# Altium project IO_board.PrjPCB
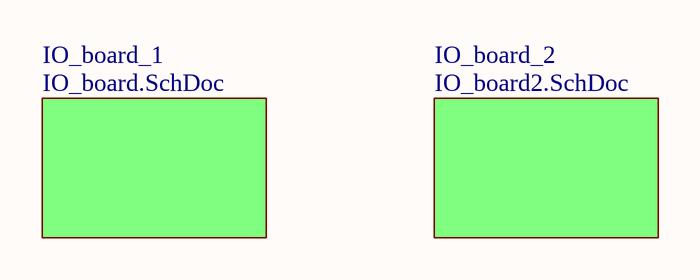
[diagram p0: IO_board_Top.SchDoc]
3 sheets, 152 parts. Net scope: global (net labels, ports and power ports of the same name join across sheets).
Board file: IO_board.PcbDoc
Sheets:
  IO_board_Top.SchDoc
    IO_board_1 = IO_board.SchDoc
    IO_board_2 = IO_board2.SchDoc

## Sheet IO_board_Top.SchDoc
size 294 x 198 mm

### Sub-sheets
IO_board_1 = IO_board.SchDoc: no entries
IO_board_2 = IO_board2.SchDoc: no entries

## Sheet IO_board.SchDoc
size 294 x 198 mm
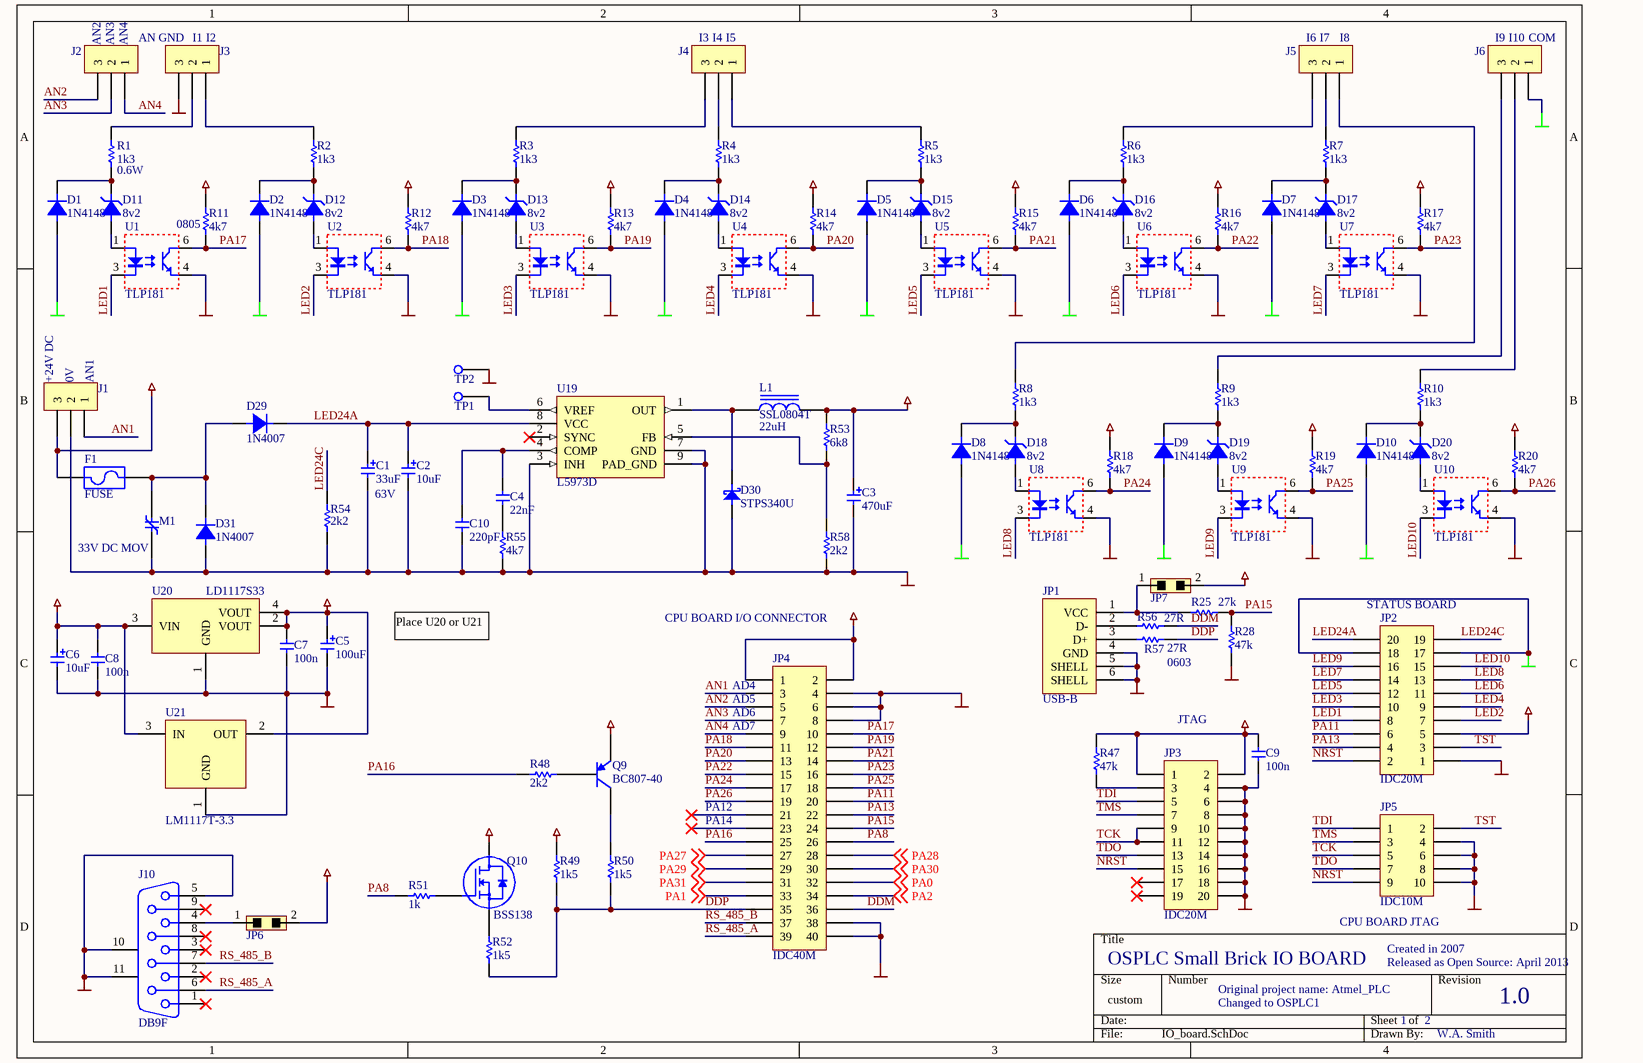
[diagram p1: IO_board.SchDoc]

### Parts
C1  63V  value 33uF  [CAP_100_RP]
C2  value 10uF  [CAP_100_RP]  (hidden comment: CAP_100_RP)
C3  value 470uF  [CAP_200_RP]  (hidden comment: CAP_200_RP)
C4  value 22nF  [0805]  (hidden comment: 0805)
C5  value 100uF  [CAP_100_RP]  (hidden comment: CAP_100_RP)
C6  value 10uF  [CAP_100_RP]  (hidden comment: CAP_100_RP)
C7  value 100n  [0805]  (hidden comment: 0805)
C8  value 100n  [0805]  (hidden comment: 0805)
C9  value 100n  [0603]  (hidden comment: 0603)
C10  value 220pF  [0805]  (hidden comment: 0805)
D1  value 1N4148  [DIODE_RAD_2.5MM]  (hidden comment: 1N4148_RAD)
D2  value 1N4148  [DIODE_RAD_2.5MM]  (hidden comment: 1N4148_RAD)
D3  value 1N4148  [DIODE_RAD_2.5MM]  (hidden comment: 1N4148_RAD)
D4  value 1N4148  [DIODE_RAD_2.5MM]  (hidden comment: 1N4148_RAD)
D5  value 1N4148  [DIODE_RAD_2.5MM]  (hidden comment: 1N4148_RAD)
D6  value 1N4148  [DIODE_RAD_2.5MM]  (hidden comment: 1N4148_RAD)
D7  value 1N4148  [DIODE_RAD_2.5MM]  (hidden comment: 1N4148_RAD)
D8  value 1N4148  [DIODE_RAD_2.5MM]  (hidden comment: 1N4148_RAD)
D9  value 1N4148  [DIODE_RAD_2.5MM]  (hidden comment: 1N4148_RAD)
D10  value 1N4148  [DIODE_RAD_2.5MM]  (hidden comment: 1N4148_RAD)
D11  value 8v2  [DIODE_RAD_2.5MM]  (hidden comment: 500mW Zener)
D12  value 8v2  [DIODE_RAD_2.5MM]  (hidden comment: 500mW Zener)
D13  value 8v2  [DIODE_RAD_2.5MM]  (hidden comment: 500mW Zener)
D14  value 8v2  [DIODE_RAD_2.5MM]  (hidden comment: 500mW Zener)
D15  value 8v2  [DIODE_RAD_2.5MM]  (hidden comment: 500mW Zener)
D16  value 8v2  [DIODE_RAD_2.5MM]  (hidden comment: 500mW Zener)
D17  value 8v2  [DIODE_RAD_2.5MM]  (hidden comment: 500mW Zener)
D18  value 8v2  [DIODE_RAD_2.5MM]  (hidden comment: 500mW Zener)
D19  value 8v2  [DIODE_RAD_2.5MM]  (hidden comment: 500mW Zener)
D20  value 8v2  [DIODE_RAD_2.5MM]  (hidden comment: 500mW Zener)
D29  value 1N4007  [DIODE_RAD_3MM]  (hidden comment: 1N4007 Radialy Mounted)
D30  STPS340U  [STPS2L25U]
D31  value 1N4007  [DIODE_RAD_3MM]  (hidden comment: 1N4007 Radialy Mounted)
F1  FUSE  [FUSE_5X20]
J1  PCB TERMINAL  [TERMINAL_3WAY_5MM]  (value not drawn)
J2  PCB TERMINAL  [TERMINAL_3WAY_5MM]  (value not drawn)
J3  PCB TERMINAL  [TERMINAL_3WAY_5MM]  (value not drawn)
J4  PCB TERMINAL  [TERMINAL_3WAY_5MM]  (value not drawn)
J5  PCB TERMINAL  [TERMINAL_3WAY_5MM]  (value not drawn)
J6  PCB TERMINAL  [TERMINAL_3WAY_5MM]  (value not drawn)
J10  DB9F  [DSUB1.385-2H9]
JP1  USB-B  [USB_B_VERT]
JP2  IDC20M  [IDC_20M_BOX]
JP3  IDC20M  [IDC_20M_BOX]
JP4  IDC40M  [IDC_40M_BOX]
JP5  IDC10M  [IDC_10M_BOX]
JP6  JUMPER2  [JUMPER2_254]  (value not drawn)
JP7  JUMPER2  [JUMPER2_254]  (value not drawn)
L1  SSL0804T  [SSL0804]
M1  33V DC MOV  [MOV_7.6mm]
Q9  BC807-40  [SO-G3/Y1]
Q10  BSS138  [SOT-23]
R1  0.6W  value 1k3  [RADIAL3MM]
R2  value 1k3  [RADIAL3MM]  (hidden comment: RES_RADIAL_3MM)
R3  value 1k3  [RADIAL3MM]  (hidden comment: RES_RADIAL_3MM)
R4  value 1k3  [RADIAL3MM]  (hidden comment: RES_RADIAL_3MM)
R5  value 1k3  [RADIAL3MM]  (hidden comment: RES_RADIAL_3MM)
R6  value 1k3  [RADIAL3MM]  (hidden comment: RES_RADIAL_3MM)
R7  value 1k3  [RADIAL3MM]  (hidden comment: RES_RADIAL_3MM)
R8  value 1k3  [RADIAL3MM]  (hidden comment: RES_RADIAL_3MM)
R9  value 1k3  [RADIAL3MM]  (hidden comment: RES_RADIAL_3MM)
R10  value 1k3  [RADIAL3MM]  (hidden comment: RES_RADIAL_3MM)
R11  0805  value 4k7  [0805]
R12  value 4k7  [0805]  (hidden comment: 0805)
R13  value 4k7  [0805]  (hidden comment: 0805)
R14  value 4k7  [0805]  (hidden comment: 0805)
R15  value 4k7  [0805]  (hidden comment: 0805)
R16  value 4k7  [0805]  (hidden comment: 0805)
R17  value 4k7  [0805]  (hidden comment: 0805)
R18  value 4k7  [0805]  (hidden comment: 0805)
R19  value 4k7  [0805]  (hidden comment: 0805)
R20  value 4k7  [0805]  (hidden comment: 0805)
R25  value 27k  [0805]  (hidden comment: 0805)
R28  value 47k  [0805]  (hidden comment: 0805)
R47  value 47k  [0805]  (hidden comment: 0805)
R48  value 2k2  [0805]  (hidden comment: 0805)
R49  value 1k5  [0805]  (hidden comment: 0805)
R50  value 1k5  [0805]  (hidden comment: 0805)
R51  value 1k  [0805]  (hidden comment: 0805)
R52  value 1k5  [0805]  (hidden comment: 0805)
R53  value 6k8  [0805]  (hidden comment: 0805)
R54  value 2k2  [AXIAL-0.3]  (hidden comment: Res1)
R55  value 4k7  [0805]  (hidden comment: 0805)
R56  value 27R  [0603]  (hidden comment: 0603)
R57  0603  value 27R  [0603]
R58  value 2k2  [0805]  (hidden comment: 0805)
TP1  TEST POINT  [TEST_POINT_TH]  (value not drawn)
TP2  TEST POINT  [TEST_POINT_TH]  (value not drawn)
U1  TLP181  [SOP4_2.54]
U2  TLP181  [SOP4_2.54]
U3  TLP181  [SOP4_2.54]
U4  TLP181  [SOP4_2.54]
U5  TLP181  [SOP4_2.54]
U6  TLP181  [SOP4_2.54]
U7  TLP181  [SOP4_2.54]
U8  TLP181  [SOP4_2.54]
U9  TLP181  [SOP4_2.54]
U10  TLP181  [SOP4_2.54]
U19  L5973D  [HSOP8]
U20  LD1117S33  [SOT-223]
U21  LM1117T-3.3  [TO220]

### Nets
GND: C1.2 C2.2 C3.2 C5.2 C6.2 C7.2 C8.2 C9.2 C10.1 D30.2(A) D31.2(A) J1.2 J3.3 J10.5 J10.10(MH1) J10.11(MH2) JP1.4(GND) JP1.5(SHELL) JP1.6(SHELL) JP2.1 JP3.4 JP3.6 JP3.8 JP3.10 JP3.12 JP3.14 JP3.16 JP3.18 JP3.20 JP4.4 JP4.6 JP4.8 JP4.38 JP4.40 JP5.4 JP5.6 JP5.8 JP5.10 M1.1 R28.1 R54.1 R55.1 R58.1 TP2.1 U1.4 U2.4 U3.4 U4.4 U5.4 U6.4 U7.4 U8.4 U9.4 U10.4 U19.3(INH) U19.7(GND) U19.9(PAD_GND) U20.1(GND) U21.1(GND)
IN_GND: D1.2(A) D2.2(A) D3.2(A) D4.2(A) D5.2(A) D6.2(A) D7.2(A) D8.2(A) D9.2(A) D10.2(A) J6.1 JP2.17 JP2.18
VCC3v3: C5.1 C7.1 C9.1 JP2.5 JP3.1 JP3.2 JP4.1 JP4.2 Q9.2(E) Q10.3(D) R11.2 R12.2 R13.2 R14.2 R15.2 R16.2 R17.2 R18.2 R19.2 R20.2 R47.2 R49.2 U20.2(VOUT) U20.4(VOUT) U21.2(OUT)
VCC5: C3.1 C6.1 C8.1 JP6.2 JP7.2 L1.2 R53.2 U20.3(VIN) U21.3(IN)
VCC24: F1.1 J1.3
AN1: J1.1 JP4.3
AN2: J2.3 JP4.5
AN3: J2.2 JP4.7
AN4: J2.1 JP4.9
DDM: JP4.36 R56.2
DDP: JP4.35 R49.1 R50.1 R52.1 R57.2
LED1: JP2.8 U1.3
LED2: JP2.7 U2.3
LED3: JP2.10 U3.3
LED4: JP2.9 U4.3
LED5: JP2.12 U5.3
LED6: JP2.11 U6.3
LED7: JP2.14 U7.3
LED8: JP2.13 U8.3
LED9: JP2.16 U9.3
LED10: JP2.15 U10.3
LED24A: C1.1 C2.1 D29.1(C) JP2.20 U19.8(VCC)
LED24C: JP2.19 R54.2
NRST: JP2.2 JP3.15 JP5.9
PA0: JP4.32 ; off-sheet PA0
PA1: JP4.33 ; off-sheet PA1
PA2: JP4.34 ; off-sheet PA2
PA8: JP4.26 R51.1
PA11: JP2.6 JP4.20
PA13: JP2.4 JP4.22
PA15: JP4.24 R25.2 R28.2
PA16: JP4.25 R48.1
PA17: JP4.10 R11.1 U1.6
PA18: JP4.11 R12.1 U2.6
PA19: JP4.12 R13.1 U3.6
PA20: JP4.13 R14.1 U4.6
PA21: JP4.14 R15.1 U5.6
PA22: JP4.15 R16.1 U6.6
PA23: JP4.16 R17.1 U7.6
PA24: JP4.17 R18.1 U8.6
PA25: JP4.18 R19.1 U9.6
PA26: JP4.19 R20.1 U10.6
PA27: JP4.27 ; off-sheet PA27
PA28: JP4.28 ; off-sheet PA28
PA29: JP4.29 ; off-sheet PA29
PA30: JP4.30 ; off-sheet PA30
PA31: JP4.31 ; off-sheet PA31
RS_485_A: J10.6 JP4.39
RS_485_B: J10.7 JP4.37
TCK: JP3.9 JP3.11 JP5.5
TDI: JP3.5 JP5.1
TDO: JP3.13 JP5.7
TMS: JP3.7 JP5.3
TST: JP2.3 JP5.2
NetC4_1: C4.1 R55.2
NetC4_2: C4.2 C10.2 U19.4(COMP)
NetD1_1: D1.1(C) D11.1(C) R1.1
NetD2_1: D2.1(C) D12.1(C) R2.1
NetD3_1: D3.1(C) D13.1(C) R3.1
NetD4_1: D4.1(C) D14.1(C) R4.1
NetD5_1: D5.1(C) D15.1(C) R5.1
NetD6_1: D6.1(C) D16.1(C) R6.1
NetD7_1: D7.1(C) D17.1(C) R7.1
NetD8_1: D8.1(C) D18.1(C) R8.1
NetD9_1: D9.1(C) D19.1(C) R9.1
NetD10_1: D10.1(C) D20.1(C) R10.1
NetD11_2: D11.2(A) U1.1
NetD12_2: D12.2(A) U2.1
NetD13_2: D13.2(A) U3.1
NetD14_2: D14.2(A) U4.1
NetD15_2: D15.2(A) U5.1
NetD16_2: D16.2(A) U6.1
NetD17_2: D17.2(A) U7.1
NetD18_2: D18.2(A) U8.1
NetD19_2: D19.2(A) U9.1
NetD20_2: D20.2(A) U10.1
NetD29_2: D29.2(A) D31.1(C) F1.2 M1.2
NetD30_1: D30.1(C) L1.1 U19.1(OUT)
NetJ3_1: J3.1 R2.2
NetJ3_2: J3.2 R1.2
NetJ4_1: J4.1 R5.2
NetJ4_2: J4.2 R4.2
NetJ4_3: J4.3 R3.2
NetJ5_1: J5.1 R8.2
NetJ5_2: J5.2 R7.2
NetJ5_3: J5.3 R6.2
NetJ6_2: J6.2 R10.2
NetJ6_3: J6.3 R9.2
NetJ10_4: J10.4 JP6.1
NetJP1_1: JP1.1(VCC) JP7.1 R25.1
NetJP1_2: JP1.2(D-) R56.1
NetJP1_3: JP1.3(D+) R57.1
NetJP3_3: JP3.3 R47.1
NetQ9_1: Q9.1(B) R48.2
NetQ9_3: Q9.3(C) R50.2
NetQ10_1: Q10.1(G) R51.2
NetQ10_2: Q10.2(S) R52.2
NetR53_1: R53.1 R58.2 U19.5(FB)
NetTP1_1: TP1.1 U19.6(VREF)

Not connected (* = marked no-connect by the designer): J10 1* 2* 3* 8* 9*; JP3 17* 19*; JP4 21* 23*; U19 2(SYNC)*

### Notes on the sheet
- (near J2) AN2
- (near J2) AN3
- (near J2) AN4
- AN GND
- (near J3) I1
- (near J3) I2
- (near J4) I3
- (near J4) I4
- (near J4) I5
- (near J5) I6
- (near J5) I7
- (near J5) I8
- (near J6) I9
- (near J6) I10
- (near J6) COM
- (near J1) +24V DC
- (near J1) 0V
- (near J1) AN1
- (near JP2) STATUS BOARD
- Place U20 or U21
- CPU BOARD I/O CONNECTOR
- (near JP4) AD4
- (near JP4) AD5
- (near JP4) AD6
- (near JP4) AD7
- JTAG
- (near JP4) PA12
- (near JP4) PA14
- (near JP5) CPU BOARD JTAG
- Created in 2007
- OSPLC Small Brick IO BOARD
- Original project name: Atmel_PLC
- Changed to OSPLC1
- Released as Open Source: April 2013
- 1.0
- 1
- 2
- W.A. Smith
- (in symbol SSL0804T) 22uH

### Library data of the parts
C1 C2 C5 C6 = CAP_100_RP: Electrolytic cap, 100 mil pitch
C3 = CAP_200_RP: Radial Electrolytic Capacitor, 200 thou pin spacing
C4 C7 C8 C10 = CAP_0805: 0805 footprint non-polarised capacitor
C9 = CAP_0603: 0603 footprint non-polorised capacitor
D1-D10 = 1N4148: Small signal diode
D11-D20 = ZENDER_500MW: 500mW Zener Diode
D29 D31 = 1N4007: 1N4007 Rectifier Diode Radialy Mounted
D30 = STPS340U: Power Schottky rectifier, ST
F1 = FUSE_5X20: 5mm by 20mm Fuse
J1-J6 = TERMINAL_3WAY_5MM: 5mm spaced PCB terminal, 3 pole
J10 = D Connector 9: Receptacle Assembly, 9 Position, Right Angle; Manufacturer: Generic Components; Package Information: Latest Revision: O; Positions: 9; Published: 15-Jun-2001; Revision: July-2002: Re-released for DXP Platform.; Datasheet: (1-Sep-1999); Package Reference: 788750; Publisher: Altium Limited; Class I: Connector; Orientation: Right Angle; Gender: Receptacle
JP1 = USB_B_VERT: Vertically mounting USB type B connector
JP2 JP3 = IDC_20M: 20 pin IDC male connector, vertical, box
JP4 = IDC_40M: 40 pin IDC male connector, vertical, box
JP5 = IDC_10M: 10 pin IDC male connector, vertical, box
JP6 JP7 = JUMPER2: 2 Pin Jumper, 2.54mm
L1 = SSL0804T: Yageo SMD Power Inductor
M1 = MOV_7.6MM: Metal Oxide Varistor
Q9 = BC807-40: PNP General Purpose Amplifier; Manufacturer: Fairchild Semiconductor; Revision 1: 11-July-2000: SIM Model Added.; Revision 2: July-2002: Re-released for DXP Platform.; Package Information: Latest Revision: Sep-1998; Class I: Discrete; Class II: BJT - Low Power; Published: 8-Jun-2000; Datasheet: Latest Revision: 1997; Package Reference: SOT-23A; Publisher: Altium Limited
Q10 = BSS138: Fairchild, N-channel MOSFET
R1-R10 = RES_RADIAL_3MM: Radialy mounted resistor
R11-R20 R25 R28 R47-R53 R55 R58 = RES_0805: 0805 footprint resistor
R54 = Res1: Resistor; Manufacturer: Generic Components; Class I: Passive; Published: 8-Jun-2000; Revision: July-2002: Re-released for DXP Platform.; Publisher: Altium Limited; Class II: Resistor
R56 R57 = RES_0603: 0603 footprint resistor
TP1 TP2 = TEST_POINT_TH: Through hole test point
U1-U10 = TLP181: Toshiba Photocoupler
  U1: Value: TLP181
U19 = L5973D: ST 2.5A switch step down switching regulator
U20 = LD1117S33: ST 3.3V LDO regulator
U21 = LM1117T3.3_VERT: 3.3V Regulator, 800mA, Vertical Mounted

## Sheet IO_board2.SchDoc
size 294 x 198 mm
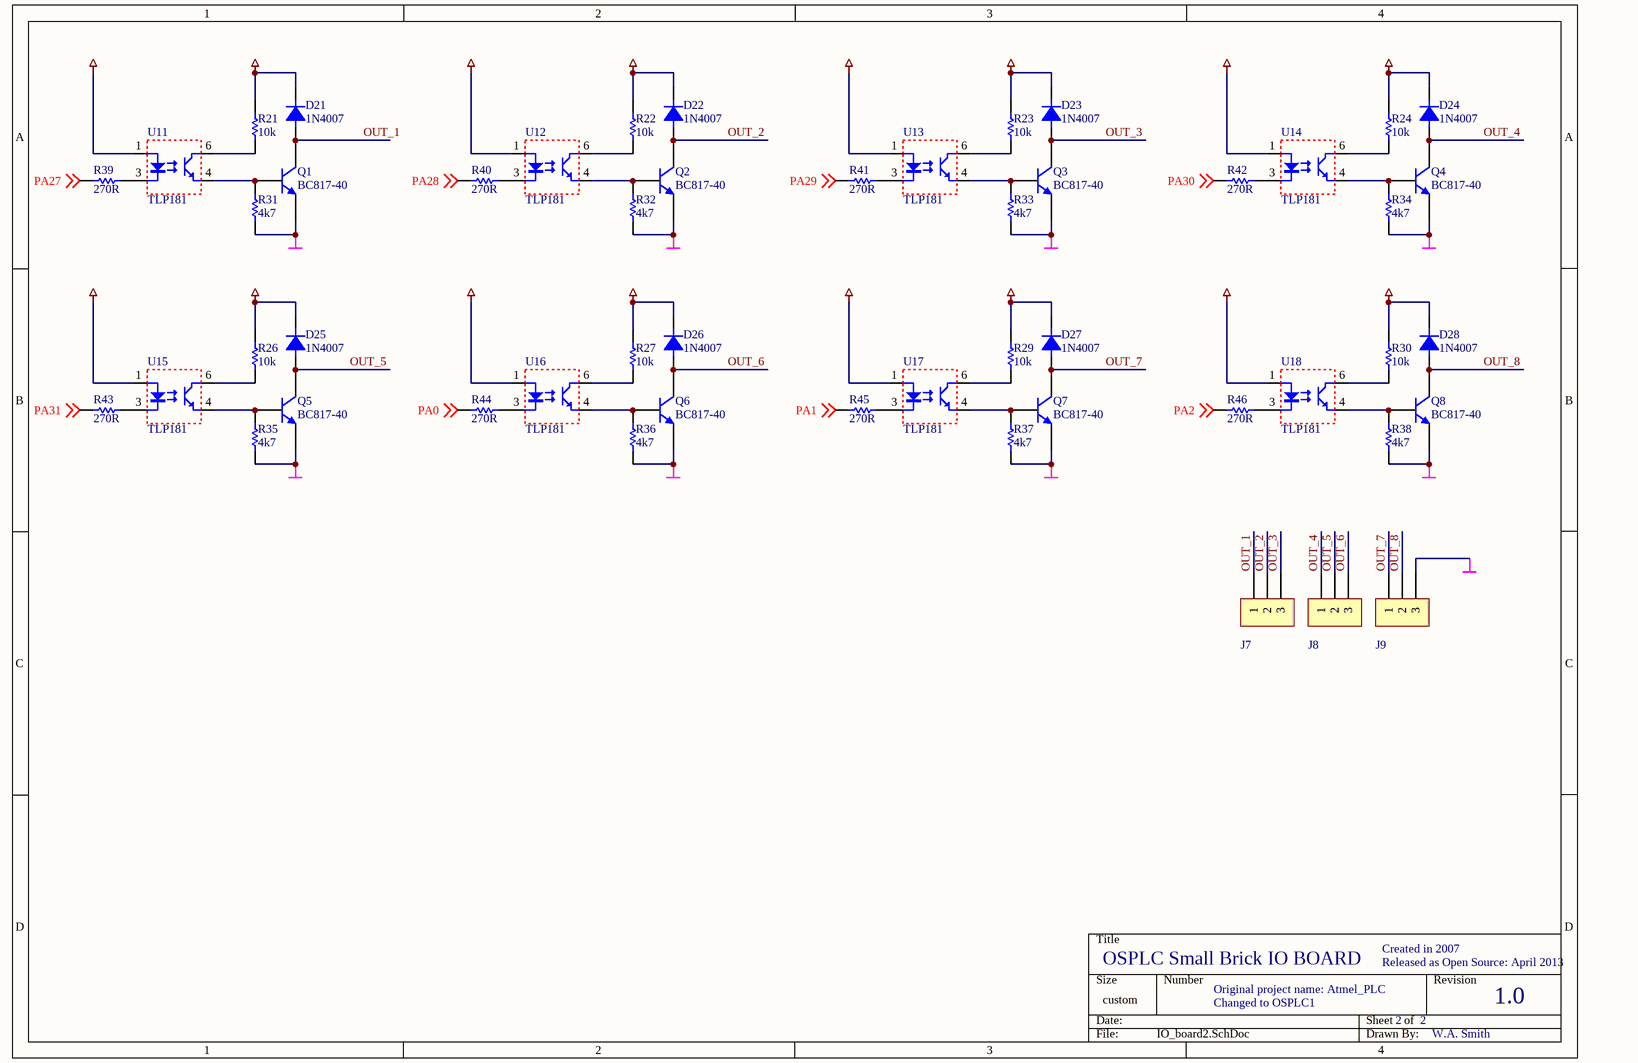
[diagram p2: IO_board2.SchDoc]

### Parts
D21  value 1N4007  [DIODE_RAD_3MM]  (hidden comment: 1N4007 Radialy Mounted)
D22  value 1N4007  [DIODE_RAD_3MM]  (hidden comment: 1N4007 Radialy Mounted)
D23  value 1N4007  [DIODE_RAD_3MM]  (hidden comment: 1N4007 Radialy Mounted)
D24  value 1N4007  [DIODE_RAD_3MM]  (hidden comment: 1N4007 Radialy Mounted)
D25  value 1N4007  [DIODE_RAD_3MM]  (hidden comment: 1N4007 Radialy Mounted)
D26  value 1N4007  [DIODE_RAD_3MM]  (hidden comment: 1N4007 Radialy Mounted)
D27  value 1N4007  [DIODE_RAD_3MM]  (hidden comment: 1N4007 Radialy Mounted)
D28  value 1N4007  [DIODE_RAD_3MM]  (hidden comment: 1N4007 Radialy Mounted)
J7  PCB TERMINAL  [TERMINAL_3WAY_5MM]  (value not drawn)
J8  PCB TERMINAL  [TERMINAL_3WAY_5MM]  (value not drawn)
J9  PCB TERMINAL  [TERMINAL_3WAY_5MM]  (value not drawn)
Q1  BC817-40  [SO-G3/Y1]
Q2  BC817-40  [SO-G3/Y1]
Q3  BC817-40  [SO-G3/Y1]
Q4  BC817-40  [SO-G3/Y1]
Q5  BC817-40  [SO-G3/Y1]
Q6  BC817-40  [SO-G3/Y1]
Q7  BC817-40  [SO-G3/Y1]
Q8  BC817-40  [SO-G3/Y1]
R21  value 10k  [0805]  (hidden comment: 0805)
R22  value 10k  [0805]  (hidden comment: 0805)
R23  value 10k  [0805]  (hidden comment: 0805)
R24  value 10k  [0805]  (hidden comment: 0805)
R26  value 10k  [0805]  (hidden comment: 0805)
R27  value 10k  [0805]  (hidden comment: 0805)
R29  value 10k  [0805]  (hidden comment: 0805)
R30  value 10k  [0805]  (hidden comment: 0805)
R31  value 4k7  [0805]  (hidden comment: 0805)
R32  value 4k7  [0805]  (hidden comment: 0805)
R33  value 4k7  [0805]  (hidden comment: 0805)
R34  value 4k7  [0805]  (hidden comment: 0805)
R35  value 4k7  [0805]  (hidden comment: 0805)
R36  value 4k7  [0805]  (hidden comment: 0805)
R37  value 4k7  [0805]  (hidden comment: 0805)
R38  value 4k7  [0805]  (hidden comment: 0805)
R39  value 270R  [0805]  (hidden comment: 0805)
R40  value 270R  [0805]  (hidden comment: 0805)
R41  value 270R  [0805]  (hidden comment: 0805)
R42  value 270R  [0805]  (hidden comment: 0805)
R43  value 270R  [0805]  (hidden comment: 0805)
R44  value 270R  [0805]  (hidden comment: 0805)
R45  value 270R  [0805]  (hidden comment: 0805)
R46  value 270R  [0805]  (hidden comment: 0805)
U11  TLP181  [SOP4_2.54]
U12  TLP181  [SOP4_2.54]
U13  TLP181  [SOP4_2.54]
U14  TLP181  [SOP4_2.54]
U15  TLP181  [SOP4_2.54]
U16  TLP181  [SOP4_2.54]
U17  TLP181  [SOP4_2.54]
U18  TLP181  [SOP4_2.54]

### Nets
OUT_GND: J9.3 Q1.2(E) Q2.2(E) Q3.2(E) Q4.2(E) Q5.2(E) Q6.2(E) Q7.2(E) Q8.2(E) R31.1 R32.1 R33.1 R34.1 R35.1 R36.1 R37.1 R38.1
VCC3v3: U11.1 U12.1 U13.1 U14.1 U15.1 U16.1 U17.1 U18.1
VCC24: D21.1(C) D22.1(C) D23.1(C) D24.1(C) D25.1(C) D26.1(C) D27.1(C) D28.1(C) R21.2 R22.2 R23.2 R24.2 R26.2 R27.2 R29.2 R30.2
OUT_1: D21.2(A) J7.1 Q1.3(C)
OUT_2: D22.2(A) J7.2 Q2.3(C)
OUT_3: D23.2(A) J7.3 Q3.3(C)
OUT_4: D24.2(A) J8.1 Q4.3(C)
OUT_5: D25.2(A) J8.2 Q5.3(C)
OUT_6: D26.2(A) J8.3 Q6.3(C)
OUT_7: D27.2(A) J9.1 Q7.3(C)
OUT_8: D28.2(A) J9.2 Q8.3(C)
PA0: R44.1 ; off-sheet PA0
PA1: R45.1 ; off-sheet PA1
PA2: R46.1 ; off-sheet PA2
PA27: R39.1 ; off-sheet PA27
PA28: R40.1 ; off-sheet PA28
PA29: R41.1 ; off-sheet PA29
PA30: R42.1 ; off-sheet PA30
PA31: R43.1 ; off-sheet PA31
NetQ1_1: Q1.1(B) R31.2 U11.4
NetQ2_1: Q2.1(B) R32.2 U12.4
NetQ3_1: Q3.1(B) R33.2 U13.4
NetQ4_1: Q4.1(B) R34.2 U14.4
NetQ5_1: Q5.1(B) R35.2 U15.4
NetQ6_1: Q6.1(B) R36.2 U16.4
NetQ7_1: Q7.1(B) R37.2 U17.4
NetQ8_1: Q8.1(B) R38.2 U18.4
NetR21_1: R21.1 U11.6
NetR22_1: R22.1 U12.6
NetR23_1: R23.1 U13.6
NetR24_1: R24.1 U14.6
NetR26_1: R26.1 U15.6
NetR27_1: R27.1 U16.6
NetR29_1: R29.1 U17.6
NetR30_1: R30.1 U18.6
NetR39_2: R39.2 U11.3
NetR40_2: R40.2 U12.3
NetR41_2: R41.2 U13.3
NetR42_2: R42.2 U14.3
NetR43_2: R43.2 U15.3
NetR44_2: R44.2 U16.3
NetR45_2: R45.2 U17.3
NetR46_2: R46.2 U18.3

### Notes on the sheet
- Created in 2007
- OSPLC Small Brick IO BOARD
- Original project name: Atmel_PLC
- Changed to OSPLC1
- Released as Open Source: April 2013
- 1.0
- 2
- W.A. Smith

### Library data of the parts
D21-D28 = 1N4007: 1N4007 Rectifier Diode Radialy Mounted
J7-J9 = TERMINAL_3WAY_5MM: 5mm spaced PCB terminal, 3 pole
Q1-Q8 = BC817-40: NPN General Purpose Amplifier; Manufacturer: Fairchild Semiconductor; Revision 1: 11-July-2000: SIM Model Added.; Revision 2: July-2002: Re-released for DXP Platform.; Package Information: Latest Revision: Sep-1998; Class I: Discrete; Class II: BJT - Low Power; Published: 8-Jun-2000; Datasheet: Latest Revision: 1997; Package Reference: SOT-23A; Publisher: Altium Limited
R21-R24 R26 R27 R29-R46 = RES_0805: 0805 footprint resistor
U11-U18 = TLP181: Toshiba Photocoupler

## Nets that join several sheets
VCC3v3: IO_board (25 pins), IO_board2 (8 pins)
VCC24: IO_board (F1.1 J1.3), IO_board2 (16 pins)
PA0: IO_board (JP4.32), IO_board2 (R44.1)
PA1: IO_board (JP4.33), IO_board2 (R45.1)
PA2: IO_board (JP4.34), IO_board2 (R46.1)
PA27: IO_board (JP4.27), IO_board2 (R39.1)
PA28: IO_board (JP4.28), IO_board2 (R40.1)
PA29: IO_board (JP4.29), IO_board2 (R41.1)
PA30: IO_board (JP4.30), IO_board2 (R42.1)
PA31: IO_board (JP4.31), IO_board2 (R43.1)